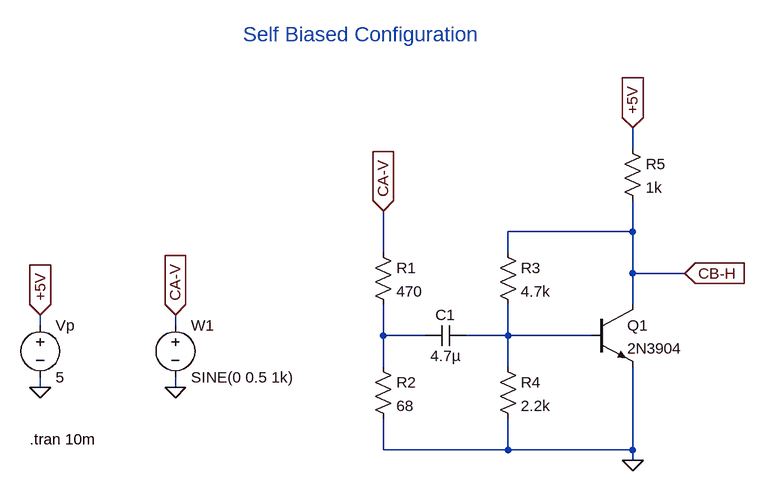
[diagram p0: schematic self_biased_config.asc]
self_biased_config.asc, the LTspice schematic file:
Version 4
SHEET 1 1228 680
WIRE 768 96 768 64
WIRE 768 224 768 176
WIRE 768 224 576 224
WIRE 384 256 384 192
WIRE 576 256 576 224
WIRE 768 288 768 224
WIRE 848 288 768 288
WIRE 768 336 768 288
WIRE -144 368 -144 352
WIRE 64 368 64 352
WIRE 384 384 384 336
WIRE 448 384 384 384
WIRE 576 384 576 336
WIRE 576 384 512 384
WIRE 704 384 576 384
WIRE 384 432 384 384
WIRE 576 432 576 384
WIRE -144 464 -144 448
WIRE 64 464 64 448
WIRE 384 560 384 512
WIRE 576 560 576 512
WIRE 576 560 384 560
WIRE 768 560 768 432
WIRE 768 560 576 560
WIRE 768 576 768 560
FLAG 768 576 0
FLAG 848 288 CB-H
IOPIN 848 288 In
FLAG 64 464 0
FLAG -144 464 0
FLAG 64 352 CA-V
IOPIN 64 352 In
FLAG -144 352 +5V
IOPIN -144 352 In
FLAG 768 64 +5V
IOPIN 768 64 In
FLAG 384 192 CA-V
IOPIN 384 192 In
SYMBOL res 368 240 R0
SYMATTR InstName R1
SYMATTR Value 470
SYMBOL res 368 416 R0
SYMATTR InstName R2
SYMATTR Value 68
SYMBOL res 560 240 R0
SYMATTR InstName R3
SYMATTR Value 4.7k
SYMBOL res 560 416 R0
SYMATTR InstName R4
SYMATTR Value 2.2k
SYMBOL res 752 80 R0
SYMATTR InstName R5
SYMATTR Value 1k
SYMBOL npn 704 336 R0
SYMATTR InstName Q1
SYMATTR Value 2N3904
SYMBOL cap 512 368 R90
WINDOW 0 0 32 VBottom 2
WINDOW 3 32 32 VTop 2
SYMATTR InstName C1
SYMATTR Value 4.7µ
SYMBOL voltage 64 352 R0
WINDOW 123 0 0 Left 0
WINDOW 39 0 0 Left 0
SYMATTR InstName W1
SYMATTR Value SINE(0 0.5 1k)
SYMBOL voltage -144 352 R0
WINDOW 123 0 0 Left 0
WINDOW 39 0 0 Left 0
SYMATTR InstName Vp
SYMATTR Value 5
TEXT 168 -80 Left 3 ;Self Biased Configuration
TEXT -160 544 Left 2 !.tran 10m

The netlist it stands for:
* self_biased_config.asc
R1 CA-V N001 470
R2 N001 0 68
R3 CB-H N002 4.7k
R4 N002 0 2.2k
R5 +5V CB-H 1k
Q1 CB-H N002 0 0 2N3904
C1 N002 N001 4.7µ
V§W1 CA-V 0 SINE(0 0.5 1k)
Vp +5V 0 5
.model NPN NPN
.model PNP PNP
.lib standard.bjt
* Self Biased Configuration
.tran 10m
.backanno
.end